# Altium schematic sheet PERMANENT.SchDoc
size A4
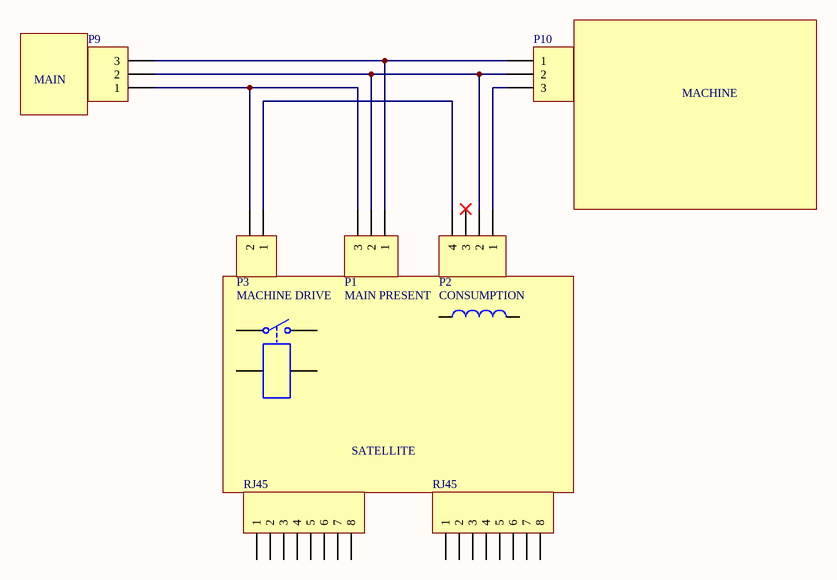
[diagram p0: PERMANENT.SchDoc]

## Parts
K?  Relay-SPST  [MODULE4]  (value not drawn)
L?  Inductor  [0402-A]  (value not drawn)
P1  MAIN PRESENT  [CO3P508]
P2  CONSUMPTION  [CO4P508]
P3  MACHINE DRIVE  [CO2P508]
P6  RJ45  [Amphenol-RJ45_8]
P7  RJ45  [Amphenol-RJ45_8]
P9  Header 3  [HDR1X3]  (value not drawn)
P10  Header 3  [HDR1X3]  (value not drawn)

## Blocks framed on the sheet
SATELLITE: K? L?

## Nets
NetP1_1: P1.1 P9.3 P10.1
NetP1_2: P1.2 P2.2 P9.2 P10.2
NetP1_3: P1.3 P3.2 P9.1
NetP2_1: P2.1 P10.3
NetP2_4: P2.4 P3.1

Not connected (* = marked no-connect by the designer): K? 1 2 3 4; L? 1 2; P2 3*; P6 1 2 3 4 5 6 7 8; P7 1 2 3 4 5 6 7 8

## Notes on the sheet
- MAIN
- MACHINE

## Library data of the parts
K? = Relay-SPST: Single-Pole Single-Throw Relay; Published: 24-Mar-1999; LatestRevisionDate: 17-Jul-2002; LatestRevisionNote: Re-released for DXP Platform.; PackageReference: MODULE4; Publisher: Altium Limited
L? = Inductor: Code_IEC: 1005; Value: 10mH; Published: 8-Jun-2000; LatestRevisionDate: 29-May-2009; LatestRevisionNote: IPC-7351 Footprint Added.; PackageReference: 0402-A; Publisher: Altium Limited; PackageDescription: Chip Inductor; Code_JEITA: 0402
P1 = Header 3: Header, 3-Pin; Manufacturer: TE CONNECTIVITY / BUCHANAN; Manufacturer Part Number: 796636-3; Supplier 1: Farnell; Supplier Part Number 1: 2059780; RoHS: YES; Pricing 1: 10=0,68, 100=0,51, 500=0,43, 1000=0,36, 2000=0,35, 5000=0,33 (EUR); ComponentLink1URL: http://www.farnell.com/cad/1652960.pdf; ComponentLink1Description: http://www.farnell.com/cad/1652960.pdf; ComponentLink2URL: http://www.farnell.com/datasheets/1650926.pdf; ComponentLink2Description: http://www.farnell.com/datasheets/1650926.pdf
P2 = Header 4: Header, 4-Pin; Manufacturer: TE CONNECTIVITY / BUCHANAN; Manufacturer Part Number: 796636-4; Supplier 1: Farnell; Supplier Part Number 1: 2059781; RoHS: YES; Stock 1: 207; ComponentLink1URL: http://www.farnell.com/cad/1652960.pdf; ComponentLink1Description: http://www.farnell.com/cad/1652960.pdf; ComponentLink2URL: http://www.farnell.com/datasheets/1650926.pdf; ComponentLink2Description: http://www.farnell.com/datasheets/1650926.pdf
P3 = Header 2: Header, 2-Pin; Manufacturer: TE CONNECTIVITY / BUCHANAN; Manufacturer Part Number: 796636-2; Terminaison du contact: Traversant vertical; Genre: Embase; Nombre de contacts: 2; Nombre de rangées: 1; Pas: 5.08; Plaquage du contact: Etain; Matériau du contact: Bronze phosphoreux<!--FANDB--><div class="features-and-benefits-container"></div>; Supplier 1: Farnell; Supplier Part Number 1: 2059815; RoHS: YES; Pricing 1: 10=0,5, 100=0,39, 500=0,34, 1000=0,27, 2000=0,211, 5000=0,207, 5000=0,203, 30000=0,199 (EUR); Gamme de produit: -; ComponentLink1URL: http://www.farnell.com/cad/1652960.pdf; ComponentLink1Description: http://www.farnell.com/cad/1652960.pdf; ComponentLink2URL: http://www.farnell.com/datasheets/1509424.pdf; ComponentLink2Description: http://www.farnell.com/datasheets/1509424.pdf
P6 P7 = Header 8: Header, 8-Pin; Manufacturer: MOLEX; Manufacturer Part Number: 85502-5008; Supplier 1: Farnell; Supplier Part Number 1: 1331561; RoHS: YES; Pricing 1: 1=1,34, 10=0,873, 50=0,797, 100=0,662, 200=0,597, 500=0,541, 500=0,496, 5000=0,493 (EUR); ComponentLink1URL: http://www.farnell.com/cad/1712028.pdf; ComponentLink1Description: http://www.farnell.com/cad/1712028.pdf; ComponentLink2URL: http://www.farnell.com/datasheets/1827260.pdf; ComponentLink2Description: http://www.farnell.com/datasheets/1827260.pdf
P9 P10 = Header 3: Header, 3-Pin; LatestRevisionDate: 17-Jul-2002; LatestRevisionNote: Re-released for DXP Platform.; Publisher: Altium Limited